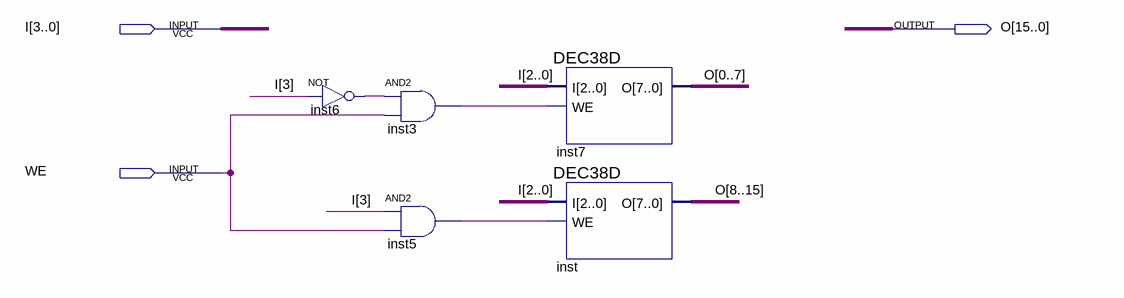
[diagram p0: schematic sheet]
// Quartus schematic DEC416D.bdf as structural Verilog: 5 symbols, 3 pins
module DEC416D (
  input  [3:0] I,
  input  WE,
  output [15:0] O
);

  wire inst3_out, inst5_out, inst6_out;

  not inst6 (inst6_out, I[3]);
  and inst3 (inst3_out, inst6_out, WE);
  and inst5 (inst5_out, I[3], WE);
  DEC38D inst7 (.I(I[2:0]), .WE(inst3_out), .O({O[0], O[1], O[2], O[3], O[4], O[5], O[6], O[7]}));
  DEC38D inst (.I(I[2:0]), .WE(inst5_out), .O({O[8], O[9], O[10], O[11], O[12], O[13], O[14], O[15]}));
endmodule
